# EAGLE schematic voltage_sensor (EAGLE 9.6.2)
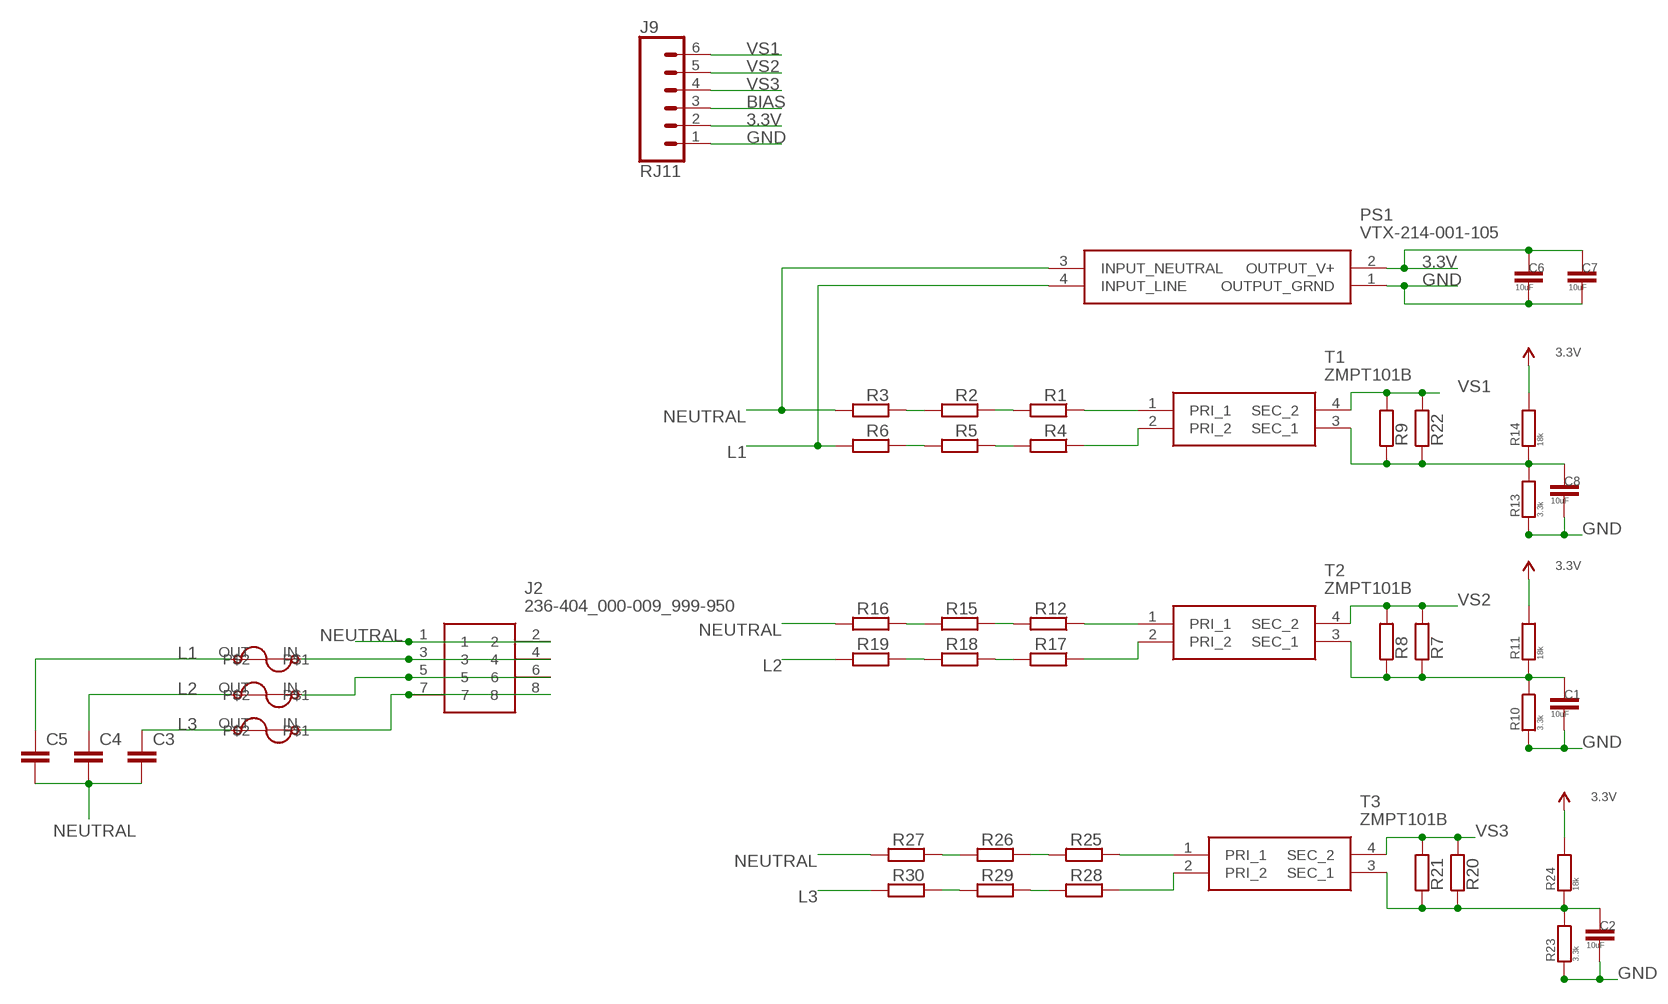
[diagram p0: schematic, sheet 1]

## Parts
C1  10uF  C-EUC0603  [C0603]
C2  10uF  C-EUC0603  [C0603]
C3  C5/2.5  [C5B2.5]
C4  C5/2.5  [C5B2.5]
C5  C5/2.5  [C5B2.5]
C6  10uF  C-EUC0603  [C0603]
C7  10uF  C-EUC0603  [C0603]
C8  10uF  C-EUC0603  [C0603]
F1  BEL1AFUSE  [BELFUSE1A]
F2  BEL1AFUSE  [BELFUSE1A]
F3  BEL1AFUSE  [BELFUSE1A]
J2  236-404_000-009_999-950  [236404000009999950]
J9  RJ11  RJ11-6  [RJ11-6]
PS1  VTX-214-001-105  [VTX214001105]
R1  R-EU_R1206  [R1206]
R2  R-EU_R1206  [R1206]
R3  R-EU_R1206  [R1206]
R4  R-EU_R1206  [R1206]
R5  R-EU_R1206  [R1206]
R6  R-EU_R1206  [R1206]
R7  R-EU_0204/7  [0204/7]
R8  R-EU_R1206  [R1206]
R9  R-EU_R1206  [R1206]
R10  3.3k  R-EU_R0603  [R0603]
R11  18k  R-EU_R0603  [R0603]
R12  R-EU_R1206  [R1206]
R13  3.3k  R-EU_R0603  [R0603]
R14  18k  R-EU_R0603  [R0603]
R15  R-EU_R1206  [R1206]
R16  R-EU_R1206  [R1206]
R17  R-EU_R1206  [R1206]
R18  R-EU_R1206  [R1206]
R19  R-EU_R1206  [R1206]
R20  R-EU_0204/7  [0204/7]
R21  R-EU_R1206  [R1206]
R22  R-EU_0204/7  [0204/7]
R23  3.3k  R-EU_R0603  [R0603]
R24  18k  R-EU_R0603  [R0603]
R25  R-EU_R1206  [R1206]
R26  R-EU_R1206  [R1206]
R27  R-EU_R1206  [R1206]
R28  R-EU_R1206  [R1206]
R29  R-EU_R1206  [R1206]
R30  R-EU_R1206  [R1206]
T1  ZMPT101B  [ZMPT101B]
T2  ZMPT101B  [ZMPT101B]
T3  ZMPT101B  [ZMPT101B]

## Nets
3.3V: C6.1 C7.1 J9.2 PS1.2(OUTPUT_V+) R11.2 R14.2 R24.2
BIAS: J9.3
GND: C1.2 C2.2 C6.2 C7.2 C8.2 J9.1 PS1.1(OUTPUT_GRND) R10.2 R13.2 R23.2
L1: C5.1 F1.OUT PS1.4(INPUT_LINE) R6.2
L2: C4.1 F2.OUT R19.2
L3: C3.1 F3.OUT R30.2
N$1: R1.1 T1.1(PRI_1)
N$2: R4.1 T1.2(PRI_2)
N$3: R1.2 R2.1
N$4: R4.2 R5.1
N$5: R5.2 R6.1
N$6: R2.2 R3.1
N$7: F1.IN J2.3 J2.4
N$8: F2.IN J2.5 J2.6
N$9: C1.1 R7.1 R8.1 R10.1 R11.1 T2.3(SEC_1)
N$10: R12.1 T2.1(PRI_1)
N$11: R17.1 T2.2(PRI_2)
N$12: R12.2 R15.1
N$13: R17.2 R18.1
N$14: R18.2 R19.1
N$15: R15.2 R16.1
N$16: F3.IN J2.7 J2.8
N$18: C2.1 R20.1 R21.1 R23.1 R24.1 T3.3(SEC_1)
N$19: R25.1 T3.1(PRI_1)
N$20: R28.1 T3.2(PRI_2)
N$21: R25.2 R26.1
N$22: R28.2 R29.1
N$23: R29.2 R30.1
N$24: R26.2 R27.1
N$25: C8.1 R9.1 R13.1 R14.1 R22.1 T1.3(SEC_1)
NEUTRAL: C3.2 C4.2 C5.2 J2.1 J2.2 PS1.3(INPUT_NEUTRAL) R3.2 R16.2 R27.2
VS1: J9.6 R9.2 R22.2 T1.4(SEC_2)
VS2: J9.5 R7.2 R8.2 T2.4(SEC_2)
VS3: J9.4 R20.2 R21.2 T3.4(SEC_2)

## Library data of the parts
C1 C2 C6-C8 = resistor:C-EU: CAPACITOR, European symbol
C3-C5 = capacitor-wima:C: CAPACITOR naming: grid - package width
F1-F3 = Qxd:BEL1AFUSE
J2 = 236-404_000-009_999-950:236-404_000-009_999-950: PCB TERMINAL STRIP, 2 SOLDER PINS/POLE, 4-POLE Source: Datasheet <https://www.wago.com/us/pcb-interconnect/ex-e-ii-pcb-terminal-strip/p/236-404_000-009_999-950>; ARROW_PART_NUMBER: 236-404/000-009/999-950; ARROW_PRICE-STOCK: https://www.arrow.com/en/products/236-404000-009999-950/wago-kontakttechnik-gmbh; DESCRIPTION: PCB TERMINAL STRIP, 2 SOLDER PINS/POLE, 4-POLE; HEIGHT: 13mm; MANUFACTURER_NAME: Wago; MANUFACTURER_PART_NUMBER: 236-404/000-009/999-950
J9 = SparkFun-Connectors:RJ11-6: RJ11 Jack - 6 pin Commonly found on CAT3 devices and some Microchip programmers. Here is the connector we sell at SparkFun: RJ11 6-Pin Connector <https://www.sparkfun.com/products/132> (PRT-00132) Datasheet <http://www.sparkfun.com/datasheets/Prototyping/Connectors/RJ11-Datasheet.pdf> It is used on this SparkFun product: SparkFun Weather Shield <https://www.sparkfun.com/products/12081> (DEV-12081) Weather Meters <https://www.sparkfun.com/products/8942> (SEN-08942); PROD_ID: CONN-08590; SF_ID: PRT-00132
PS1 = VTX-214-001-105:VTX-214-001-105: VIGORTRONIX - VTX-214-001-105 - AC-DC CONV, FIXED, 1 O/P, 1W, 5V Source: Datasheet; DESCRIPTION: VIGORTRONIX - VTX-214-001-105 - AC-DC CONV, FIXED, 1 O/P, 1W, 5V; HEIGHT: 19mm; MANUFACTURER_NAME: VIGORTRONIX; MANUFACTURER_PART_NUMBER: VTX-214-001-105
R1-R30 = rcl:R-EU_: RESISTOR, European symbol
T1-T3 = ZMPT101B:ZMPT101B: Current-type Voltage Transformer Source: Datasheet; DESCRIPTION: Current-type Voltage Transformer; HEIGHT: 18.8mm; MANUFACTURER_NAME: Qingxian Zeming Langxi Electronic; MANUFACTURER_PART_NUMBER: ZMPT101B

## Net classes
0 default: clearance 0.205 mm
1 power: width 0.305 mm, drill 0.6 mm, clearance 0.254 mm
2 gnd: width 0.254 mm, drill 0.6 mm, clearance 0.254 mm